# Altium schematic sheet Filter.SchDoc
size B
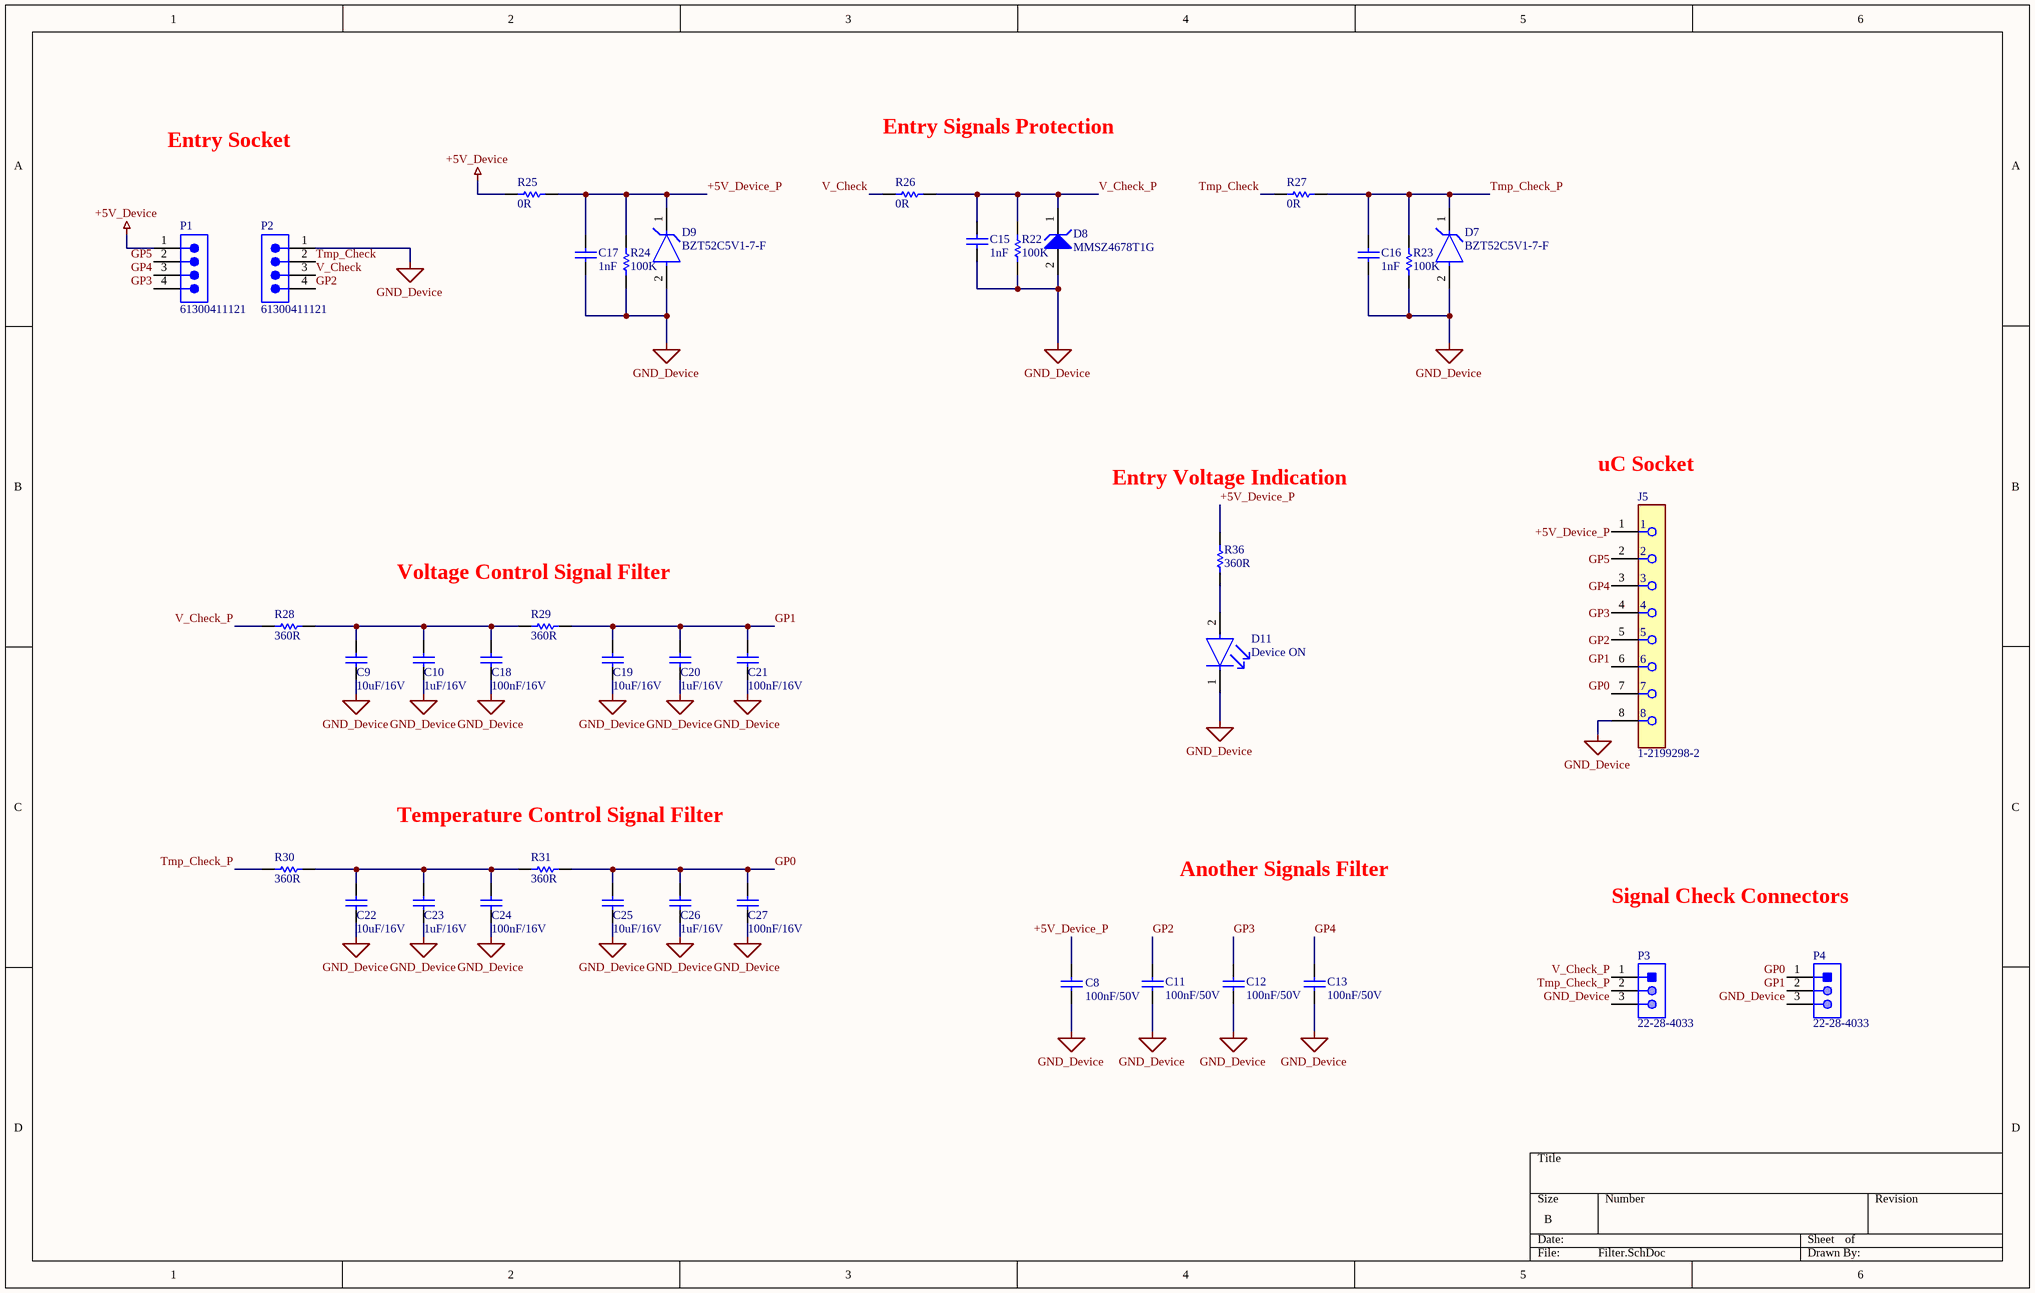
[diagram p0: Filter.SchDoc]

## Parts
C8  100nF/50V  [CAPC2013X145X48NL20T23]
C9  10uF/16V  [CAPC2013X145X48NL20T23]
C10  1uF/16V  [CAPC2013X145X48NL20T23]
C11  100nF/50V  [CAPC2013X145X48NL20T23]
C12  100nF/50V  [CAPC2013X145X48NL20T23]
C13  100nF/50V  [CAPC2013X145X48NL20T23]
C15  1nF  [CAPC2013X145X48ML20T23]
C16  1nF  [CAPC2013X145X48ML20T23]
C17  1nF  [CAPC2013X145X48ML20T23]
C18  100nF/16V  [CAPC2013X145X48NL20T23]
C19  10uF/16V  [CAPC2013X145X48NL20T23]
C20  1uF/16V  [CAPC2013X145X48NL20T23]
C21  100nF/16V  [CAPC2013X145X48NL20T23]
C22  10uF/16V  [CAPC2013X145X48NL20T23]
C23  1uF/16V  [CAPC2013X145X48NL20T23]
C24  100nF/16V  [CAPC2013X145X48NL20T23]
C25  10uF/16V  [CAPC2013X145X48NL20T23]
C26  1uF/16V  [CAPC2013X145X48NL20T23]
C27  100nF/16V  [CAPC2013X145X48NL20T23]
D7  BZT52C5V1-7-F  [FP-SOD123-MFG]
D8  MMSZ4678T1G  [ONSC-SOD-123-2-425-04_V]
D9  BZT52C5V1-7-F  [FP-SOD123-MFG]
D11  Device ON  [FP-LS_R976-MFG]
J5  1-2199298-2  [FP-1-2199298-2-MFG]
P1  61300411121  [61300411121]
P2  61300411121  [61300411121]
P3  22-28-4033  [MOLX-22-28-4033_V]
P4  22-28-4033  [MOLX-22-28-4033_V]
R22  100K  [RESC2013X55X40NL15T20]
R23  100K  [RESC2013X55X40NL15T20]
R24  100K  [RESC2013X55X40NL15T20]
R25  0R  [RESC2013X55X40NL15T20]
R26  0R  [RESC2013X55X40NL15T20]
R27  0R  [RESC2013X55X40NL15T20]
R28  360R  [RESC2013X55X40NL15T20]
R29  360R  [RESC2013X55X40NL15T20]
R30  360R  [RESC2013X55X40NL15T20]
R31  360R  [RESC2013X55X40NL15T20]
R36  360R  [RESC2013X55X40NL15T20]

## Nets
+5V_Device: P1.1 R25.2
GND_Device: C8.1 C9.1 C10.1 C11.2 C12.2 C13.2 C15.1 C16.1 C17.1 C18.1 C19.1 C20.1 C21.1 C22.1 C23.1 C24.1 C25.1 C26.1 C27.1 D7.2(A) D8.2(A) D9.2(A) D11.1(C) J5.8 P2.1 P3.3 P4.3 R22.1 R23.1 R24.1
+5V_Device_P: C8.2 C17.2 D9.1(C) J5.1 R24.2 R25.1 R36.2
GP0: C25.2 C26.2 C27.2 J5.7 P4.1 R31.1
GP1: C19.2 C20.2 C21.2 J5.6 P4.2 R29.1
GP2: C11.1 J5.5 P2.4
GP3: C12.1 J5.4 P1.4
GP4: C13.1 J5.3 P1.3
GP5: J5.2 P1.2
Tmp_Check: P2.2 R27.2
Tmp_Check_P: C16.2 D7.1(C) P3.2 R23.2 R27.1 R30.2
V_Check: P2.3 R26.2
V_Check_P: C15.2 D8.1(K) P3.1 R22.2 R26.1 R28.2
NetC9_2: C9.2 C10.2 C18.2 R28.1 R29.2
NetC22_2: C22.2 C23.2 C24.2 R30.1 R31.2
NetD11_2: D11.2(A) R36.1

## Notes on the sheet
- Entry Socket
- Entry Signals Protection
- Entry Voltage Indication
- uC Socket
- (near R29) Voltage Control Signal Filter
- (near R31) Temperature Control Signal Filter
- Another Signals Filter
- Signal Check Connectors

## Library data of the parts
C8-C13 C18-C27 = CMP-2007-03167-1: Manufacturer: Vitramon; Part Number: VJ0805Y104KNAAT
C15-C17 = CMP-2007-03154-1: Part Number: VJ0805Y102KXAMC; Manufacturer: Vitramon
D7 D9 = CMP-2000-05976-2: DIODE ZENER 5.1V 500MW SOD123; Manufacturer: Diodes Incorporated; Standoff Height: 0mm; Max Reverse Leakage Current: 2uA; Forward Current: 10mA; Power Dissipation: 370mW; Max Zener Voltage: 5.4V; Zener Impedance: 60Ω; Automotive Grade: NA; Max Junction Temp: +150°C; Device Class L3: Zener Diodes; ComponentLink2Description: Datasheet; Manufacturer Part Number: BZT52C5V1-7-F; Mouser Description: Zener Diodes 5.1V 500mW; Octopart: https://octopart.com/bzt52c5v1-7-f-diodes+inc.-326718; Package: SOD123; RoHS: TRUE; Nom Zener Voltage: 5.1V; Device Class L1: Discrete Semiconductors; Lead Free: Yes; Footprint Url: https://www.diodes.com/assets/Package-Files/SOD123.pdf; ComponentLink2URL: https://www.diodes.com/assets/Datasheets/ds18004.pdf; Digikey Description: DIODE ZENER 5.1V 500MW SOD123; Height: 1.45mm; Temperature Range Low: -65°C; Device Class L2: Diodes; Temperature: -65°C to +150°C; Automotive: No; Temperature Range High: +150°C; Category: Diode
D8 = CMP-1060-00511-1: Zener Voltage Regulator, 500 mW, 2-Pin SOD-123, Pb-Free, Tape and Reel; Manufacturer: On Semiconductor; P Max (W): 0.5; VZ Typ (V): 1.8; PackageDescription: 2-Pin SOD, Body 1.6 x 2.69 mm; ComponentLink3Description: Package Specification; PackageReference: SOD-123-2-425-04; RoHS: Pb-Free; PackageVersion: Rev. G, 10/2009; Packing: Tape and Reel; ComponentLink1URL: http://www.onsemi.com/; ComponentLink2Description: Datasheet; ComponentLink3URL: http://www.onsemi.com/pub_link/Collateral/425-04.PDF; ComponentLink2URL: http://www.onsemi.com/pub_link/Collateral/MMSZ4678T1-D.PDF; DatasheetVersion: Rev. 9; ComponentLink1Description: Manufacturer URL; Mounting Technology: Surface Mount; PartNumber: MMSZ4678T1G
D11 = CMP-62016-000037-1: LED RED DIFFUSED 0805 SMD; Lens Size: 1.25mm; Number of LEDs: 1; Luminous Intensity: 180mcd; Dominant Wavelength: 633nm; Lens Style: Flat; Reverse Voltage: 12V; Lens Color: White; Forward Voltage: 2.5V; Forward Current: 25mA; Power Dissipation: 65W; Luminous Flux: 0.47lm; Test Current: 20mA; Viewing Angle: 160°; Length: 2mm; Number of Pins: 2; Lens Transparency: Diffused; Min Operating Temperature: -30°C; Case Code (Metric): 2012; Depth: 1.35mm; Color: Red; Illumination Color: Red; Max Operating Temperature: 85°C; Mount: Surface Mount; Case/Package: 0805; Height: 0.9mm; Package Quantity: 16000; Number of Elements: 1; Radiation Hardening: No; Case Code (Imperial): 0805; Packaging: Tape and Reel; Width: 1.25mm
J5 = CMP-03370-000009-1: CONN IC DIP SOCKET 8POS TIN; Contact Post Length: 3inch; Number of Contacts: 8; Contact Current Rating: 1A; Contact Resistance: 20mR; Insulation Resistance: 1GR; Connector Type: Pin; Row Spacing: 0.3inch; Pitch: 2.54mm; Mating Alignment: Yes (With); RoHS Compliant: Yes; Packaging: Rail/Tube; Contact Material: Bronze; Lead Pitch: 2.54mm; Mount: Through Hole; Termination: Through Hole; Max Operating Temperature: 105°C; Flammability Rating: UL94 V-0; Package Quantity: 60; Contact Finish - Mating: TIN; ELV: Compliant; Radiation Hardening: No; Number of Rows: 2; Series: Diplomate DL; Color: Black; Number of Positions: 8; Contact Plating: Tin; Min Operating Temperature: -40°C; Lead Free: Lead Free; Length: 0.4inch; Orientation: Straight; Housing Material: PBT
P1 P2 = CMP-1502-01064-3: NexarPartId: 32855522; Operating Supply Voltage: 250V; Pitch: 2.54mm; Contact Resistance: 20mΩ; Number of Positions: 4; Current Rating: 3A; Connector Type: Male Pin; Gender: Male; Contact Plating: Gold; Height: 8.89mm; Lead Pitch: 2.54mm; Lead Free: Lead Free; Contact Mating Length: 5.9944mm; Number of Rows: 1; Termination: Solder; Packaging: Bulk; REACH SVHC: Unknown; Min Operating Temperature: -40°C; RoHS: Compliant; Number of Contacts: 4; Voltage Rating: 250V; Color: Black; Max Operating Temperature: 105°C; Contact Material: Copper; Mount: Through Hole; Orientation: Vertical; Number of Pins: 4
P3 P4 = CMP-1676-00001-5: Male Header, Pitch 2.54 mm, 1 x 3 Position, Height 8.38 mm, Tail Length 3.18 mm, RoHS, Bulk; Manufacturer: Molex; Rows: 1; Voltage Rating: 250 V; Current Rating: 4 A; Min Operating Temperature: 0 degC; Lead Pitch: 0.1 inch; Packaging: Bulk; Contact Finish: Gold; RoHSCompliant: true; Contact Material: Brass; PackageReference: 22-28-4033; REACH SVHC: Unknown; PackageDescription: Male Header, Pitch 2.54 mm, 1 x 3 Position, Height 8.38 mm, Tail Length 3.18 mm; ComponentLink2URL: http://www.molex.com/pdm_docs/sd/022284033_sd.pdf; Height: 8.38 mm; Mounting Technology: Through Hole; ComponentLink1Description: Manufacturer URL; Length: 7.62 mm; Mount: Through Hole; DatasheetVersion: Rev. G, 01/2012; Max Operating Temperature: 75 degC; ComponentLink2Description: Datasheet; Colour: Black; Pins: 3; Contact Plating: Gold; Package Quantity: 1; ComponentLink1URL: http://www.molex.com/
R22-R31 R36 = CMP-2001-04755-1: Manufacturer: Vishay Dale; Part Number: TNPW08052K00BEEN